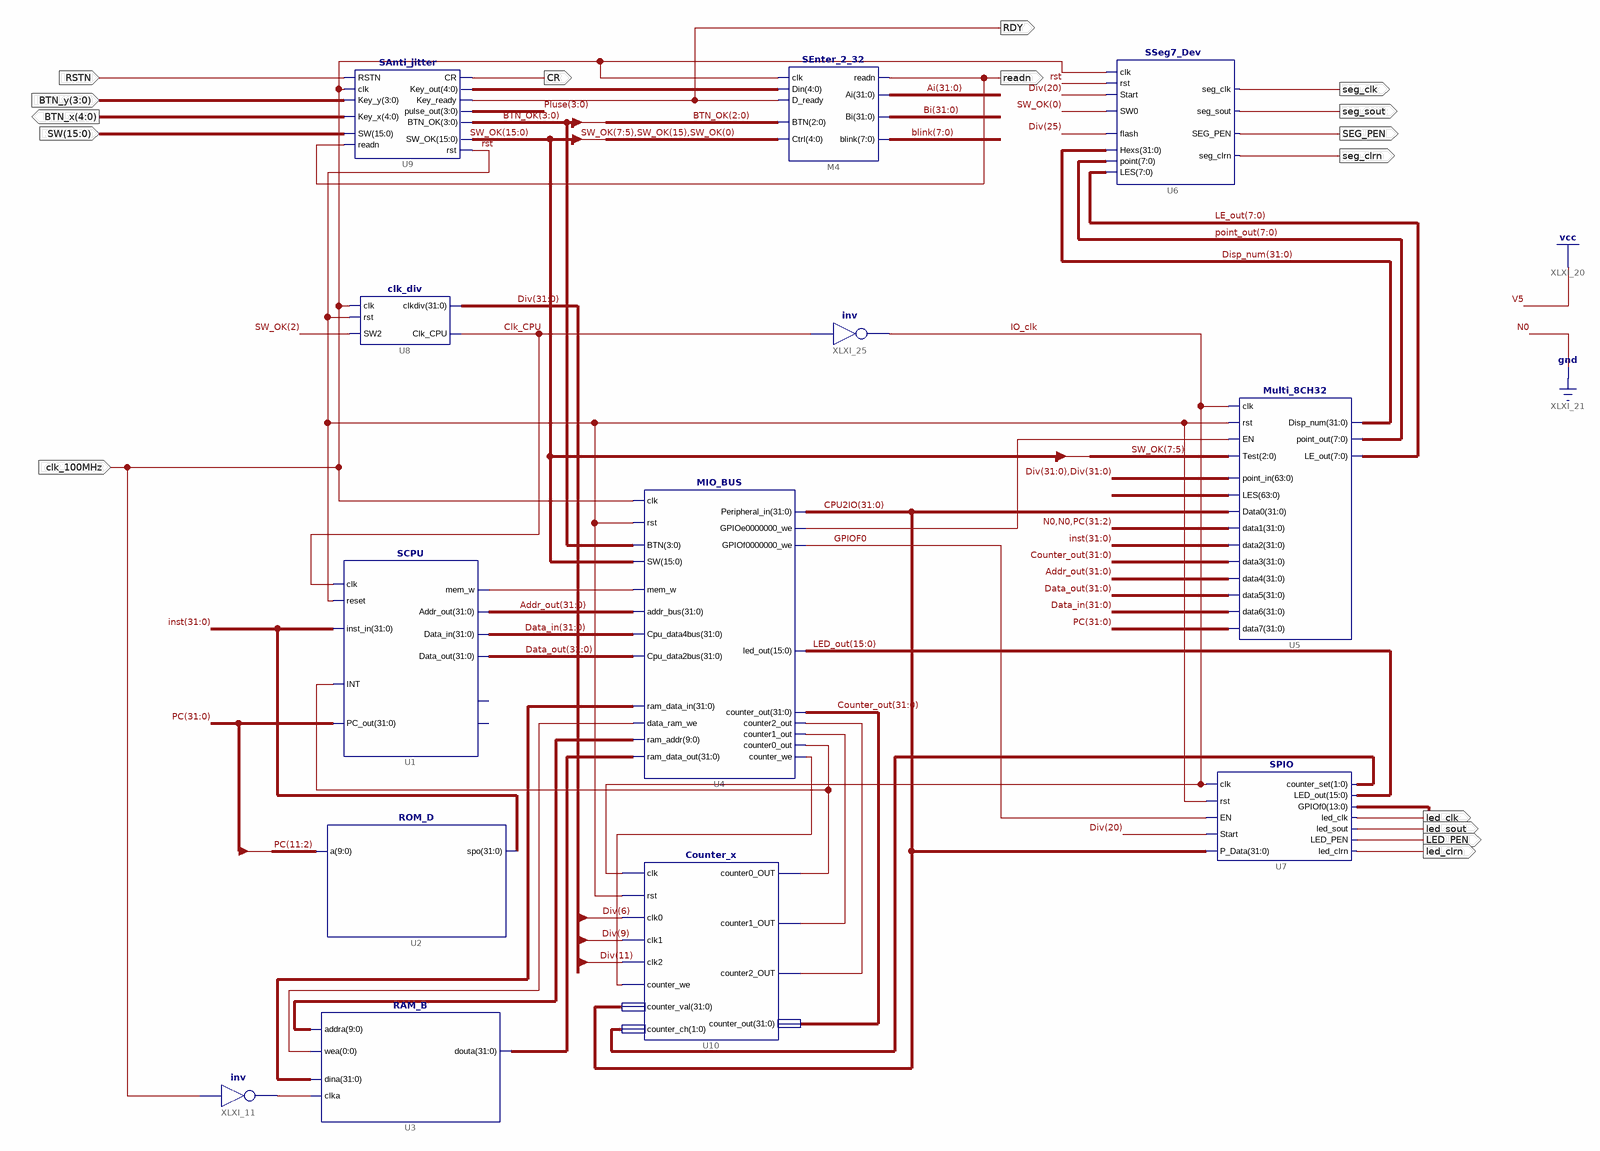
[diagram p0: schematic sheet 1]
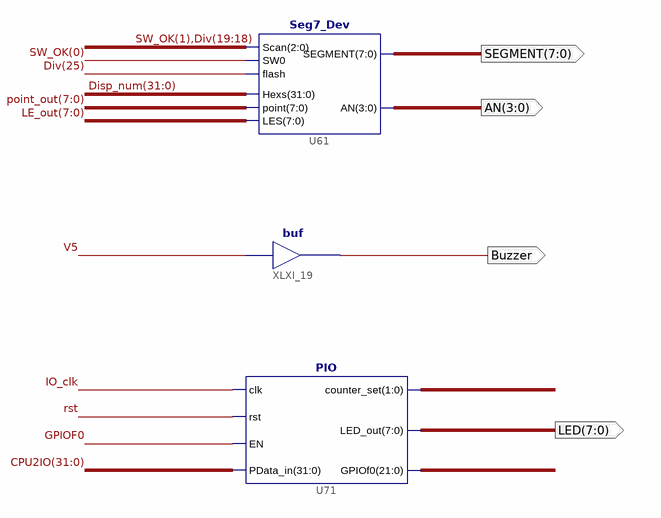
[diagram p1: schematic sheet 2]
// Xilinx ISE schematic OExp03_IP2SOC.sch (kintex7) as structural Verilog: 16 symbols, 20 ports
module OExp03_IP2SOC (
  input  RSTN,
  input  [3:0] BTN_y,
  input  [15:0] SW,
  input  clk_100MHz,
  output [4:0] BTN_x,
  output CR,
  output RDY,
  output readn,
  output seg_clk,
  output seg_sout,
  output SEG_PEN,
  output seg_clrn,
  output led_clk,
  output led_sout,
  output LED_PEN,
  output led_clrn,
  output [7:0] LED,
  output [3:0] AN,
  output [7:0] SEGMENT,
  output Buzzer
);

  wire Clk_CPU, GPIOF0, IO_clk, rst, XLXN_55, XLXN_157, XLXN_166, XLXN_190, XLXN_192, XLXN_193, XLXN_217;
  wire [0:0] XLXN_180;
  wire [1:0] XLXN_83, XLXN_196;
  wire [3:0] BTN_OK, Pluse;
  wire [4:0] XLXN_7;
  wire [7:0] blink, LE_out, point_out;
  wire [9:0] XLXN_175;
  wire [13:0] XLXN_141;
  wire [15:0] LED_out, SW_OK;
  wire [21:0] XLXN_85;
  wire [31:0] Addr_out, Ai, Bi, Counter_out, CPU2IO, Data_in, Data_out, Disp_num, Div, inst, PC, XLXN_174,
       XLXN_181;

  SAnti_jitter U9 (
    .SW(SW), .readn(readn), .Key_y(BTN_y), .Key_x(BTN_x), .RSTN(RSTN), .clk(clk_100MHz), .Key_out(XLXN_7),
    .Key_ready(RDY), .CR(CR), .rst(rst), .SW_OK(SW_OK), .pulse_out(Pluse), .BTN_OK(BTN_OK));
  clk_div U8 (.rst(rst), .clk(clk_100MHz), .SW2(SW_OK[2]), .clkdiv(Div), .Clk_CPU(Clk_CPU));
  SEnter_2_32 M4 (
    .readn(readn), .Ai(Ai), .Bi(Bi), .blink(blink), .Din(XLXN_7), .D_ready(RDY), .clk(clk_100MHz),
    .Ctrl({SW_OK[7:5], SW_OK[15], SW_OK[0]}), .BTN(BTN_OK[2:0]));
  SSeg7_Dev U6 (
    .LES(LE_out), .SEG_PEN(SEG_PEN), .seg_sout(seg_sout), .seg_clrn(seg_clrn), .point(point_out),
    .Hexs(Disp_num), .SW0(SW_OK[0]), .flash(Div[25]), .seg_clk(seg_clk), .clk(clk_100MHz), .rst(rst),
    .Start(Div[20]));
  Multi_8CH32 U5 (
    .Test(SW_OK[7:5]), .point_in({Div, Div}), .EN(XLXN_157), .clk(IO_clk), .rst(rst), .LES({64{1'b0}}),
    .Data0(CPU2IO), .data1({2'b00, PC[31:2]}), .data2(inst), .data3(Counter_out), .data4(Addr_out),
    .data5(Data_out), .data6(Data_in), .data7(PC), .point_out(point_out), .LE_out(LE_out), .Disp_num(Disp_num));
  ROM_D U2 (.a(PC[11:2]), .spo(inst));
  RAM_B U3 (.addra(XLXN_175), .clka(XLXN_55), .wea(XLXN_180[0]), .dina(XLXN_181), .douta(XLXN_174));
  not XLXI_11 (XLXN_55, clk_100MHz);
  SPIO U7 (
    .clk(IO_clk), .P_Data(CPU2IO), .rst(rst), .EN(GPIOF0), .Start(Div[20]), .led_clk(led_clk),
    .GPIOf0(XLXN_141), .LED_out(LED_out), .counter_set(XLXN_196), .led_clrn(led_clrn), .LED_PEN(LED_PEN),
    .led_sout(led_sout));
  PIO U71 (
    .clk(IO_clk), .rst(rst), .EN(GPIOF0), .PData_in(CPU2IO), .GPIOf0(XLXN_85), .LED_out(LED),
    .counter_set(XLXN_83));
  Seg7_Dev U61 (
    .LES(LE_out), .Scan({SW_OK[1], Div[19:18]}), .SEGMENT(SEGMENT), .AN(AN), .point(point_out),
    .flash(Div[25]), .SW0(SW_OK[0]), .Hexs(Disp_num));
  buf XLXI_19 (Buzzer, 1'b1);
  SCPU U1 (
    .clk(Clk_CPU), .reset(rst), .inst_in(inst), .INT(XLXN_217), .Addr_out(Addr_out), .mem_w(XLXN_166),
    .Data_out(Data_out), .Data_in(Data_in), .PC_out(PC));  // open: CPU_MIO, MIO_ready
  MIO_BUS U4 (
    .rst(rst), .clk(clk_100MHz), .mem_w(XLXN_166), .addr_bus(Addr_out), .Cpu_data4bus(Data_in),
    .Cpu_data2bus(Data_out), .ram_data_out(XLXN_174), .ram_addr(XLXN_175), .data_ram_we(XLXN_180[0]),
    .ram_data_in(XLXN_181), .counter_out(Counter_out), .counter2_out(XLXN_193), .counter1_out(XLXN_192),
    .counter0_out(XLXN_217), .counter_we(XLXN_190), .BTN(BTN_OK), .SW(SW_OK), .led_out(LED_out),
    .Peripheral_in(CPU2IO), .GPIOe0000000_we(XLXN_157), .GPIOf0000000_we(GPIOF0));
  Counter_x U10 (
    .clk(IO_clk), .rst(rst), .clk0(Div[6]), .clk1(Div[9]), .clk2(Div[11]), .counter_we(XLXN_190),
    .counter_val(CPU2IO), .counter_ch(XLXN_196), .counter0_OUT(XLXN_217), .counter1_OUT(XLXN_192),
    .counter2_OUT(XLXN_193), .counter_out(Counter_out));
  not XLXI_25 (IO_clk, Clk_CPU);
endmodule
